# EAGLE design TS1 (EAGLE 9.5.1)
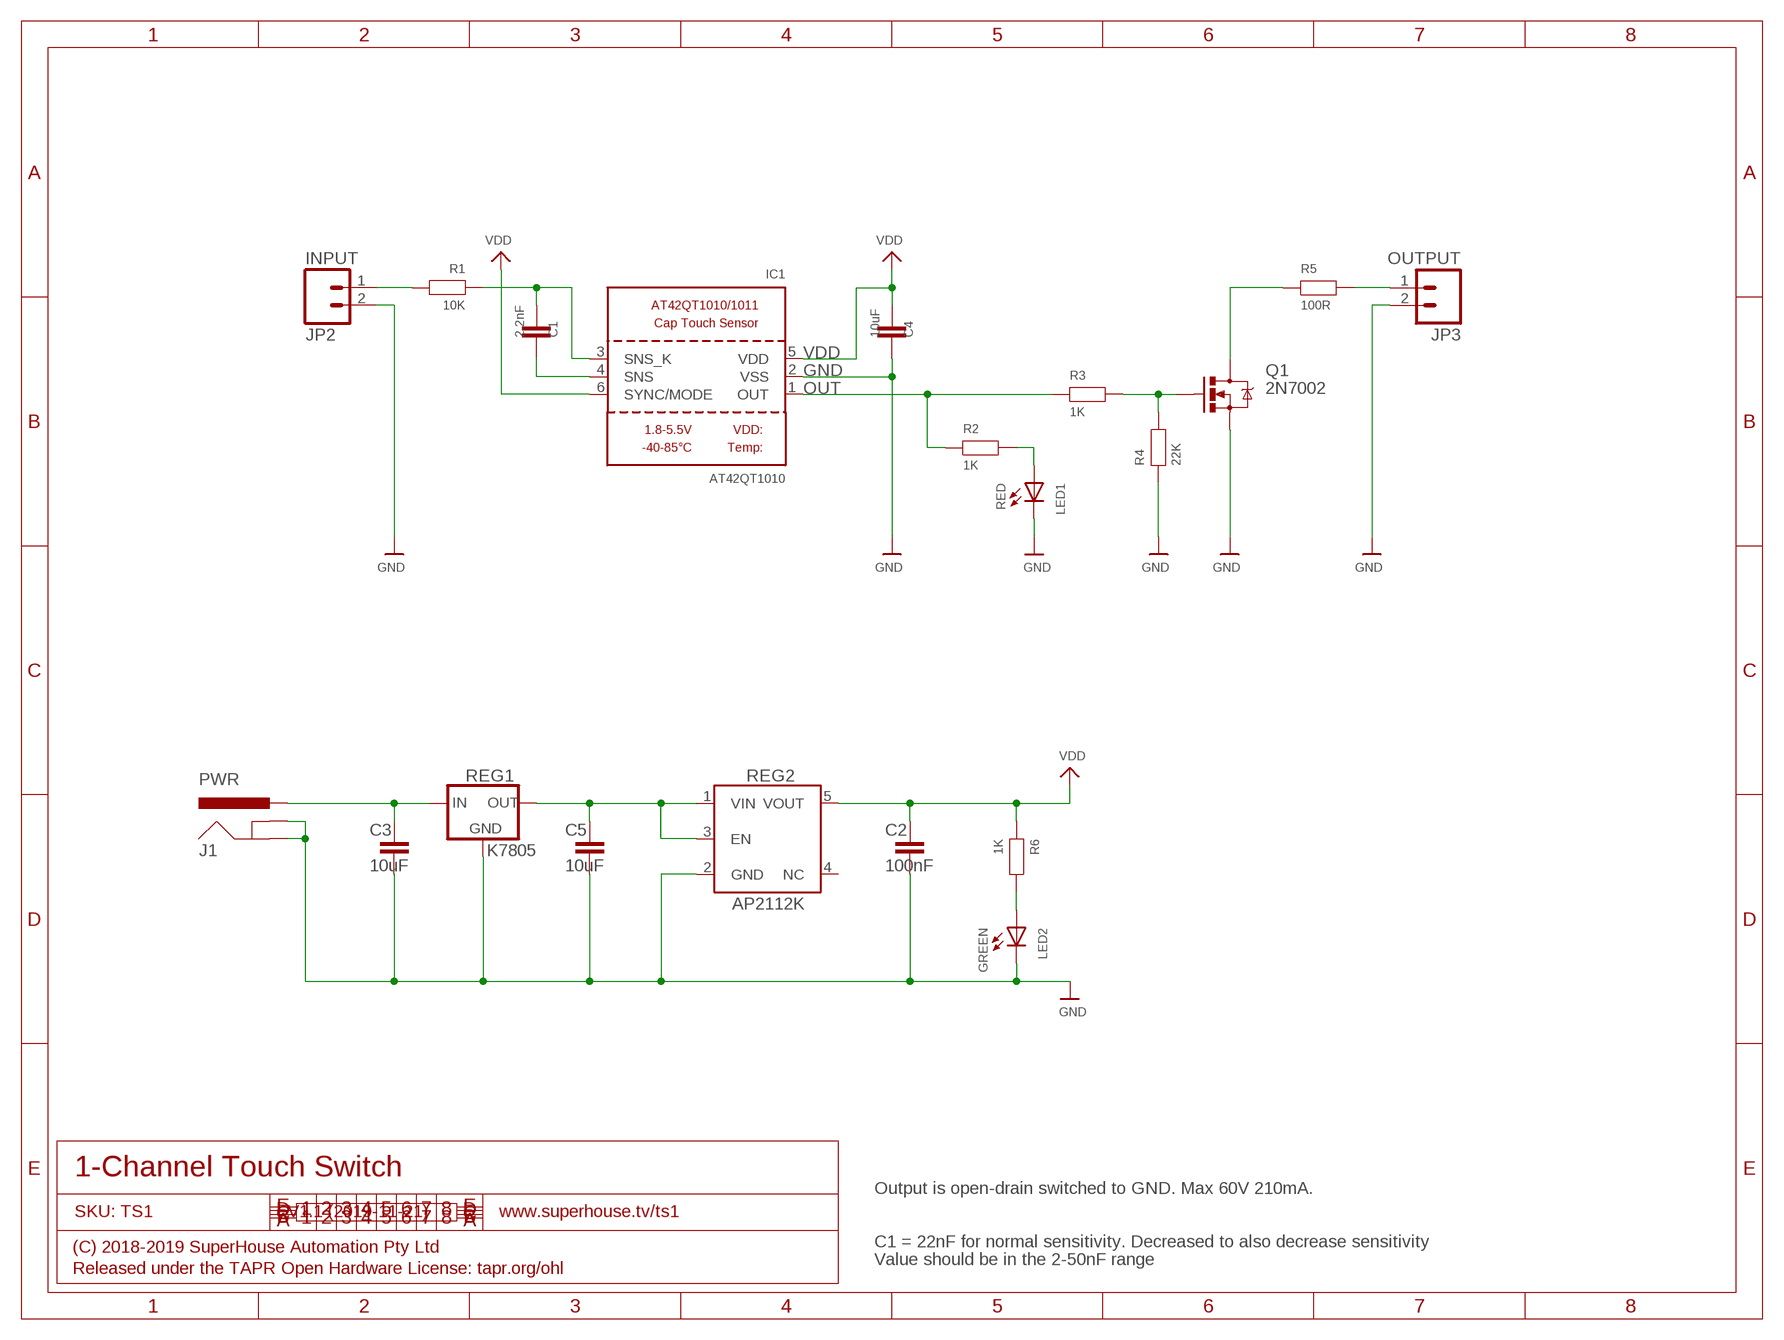
[diagram p0: schematic, sheet 1]

## Parts
C1  2.2nF  CAP0603  [C0603]
C2  100nF  CAP0603  [C0603]
C3  10uF  CAP0603  [C0603]
C4  10uF  CAP0603  [C0603]
C5  10uF  CAP0603  [C0603]
IC1  AT42QT1010  AT42QT1010/1  [SOT23-6]
J1  PWR  POWER_JACK-SLOTS  [POWER_JACK_SLOTS]
JP2  INPUT  M02-SOCKET  [1X02-S]
JP3  OUTPUT  M02-SOCKET  [1X02-S]
LED1  RED  LED0603  [LED-0603]
LED2  GREEN  LED0603  [LED-0603]
Q1  2N7002  MOSFET-NCHANNEL-233  [SOT23-3]
R1  10K  RESISTOR0603  [R0603]
R2  1K  RESISTOR0603  [R0603]
R3  1K  RESISTOR0603  [R0603]
R4  22K  RESISTOR0603  [R0603]
R5  100R  RESISTOR0603  [R0603]
R6  1K  RESISTOR0603  [R0603]
REG1  K7805  K78XX-500R3  [K78XX-500R3]
REG2  AP2112KSOT25  [SOT23-5]

## Nets
CAPPAD: JP2.1 R1.2
GND: C2.2 C3.2 C4.2 C5.2 IC1.2(VSS) J1.GND J1.GNDBREAK JP2.2 JP3.2 LED1.C LED2.C Q1.2(S) R4.1 REG1.2(GND) REG2.2(GND)
N$1: JP3.1 R5.2
N$2: Q1.3(D) R5.1
N$3: C1.2 IC1.4(SNS)
N$4: C1.1 IC1.3(SNS_K) R1.1
N$5: Q1.1(G) R3.2 R4.2
N$6: LED1.A R2.2
N$7: C3.1 J1.PWR REG1.1(IN)
N$8: C5.1 REG1.3(OUT) REG2.1(VIN) REG2.3(EN)
N$9: LED2.A R6.2
OUT: IC1.1(OUT) R2.1 R3.1
VDD: C2.1 C4.1 IC1.5(VDD) IC1.6(SYNC/MODE) R6.1 REG2.5(VOUT)
Unconnected: REG2.4(NC)

## Notes on the sheet
- 1-Channel Touch Switch
- Output is open-drain switched to GND. Max 60V 210mA.
- SKU: TS1 | V1.1 (2019-11-21) | www.superhouse.tv/ts1
- C1 = 22nF for normal sensitivity. Decreased to also decrease sensitivity
- (C) 2018-2019 SuperHouse Automation Pty Ltd
- Value should be in the 2-50nF range
- Released under the TAPR Open Hardware License: tapr.org/ohl

## Library data of the parts
C1-C5 = SuperHouse-DiscreteSemi:CAP: Capacitor Standard ceramic capacitor
IC1 = SuperHouse-ICs:AT42QT1010/1: AT42QT1010/1011 - Single Button Cap Touch Sensors AT42QT1010 - Auto recalibration AT42QT1011 - Remains on as long as touch is detected
J1 = SuperHouse-Connectors:POWER_JACK: Power Jack This is the standard 5.5mm barrel jack for power. The PTH is the most common, proven, reliable, footprint. All others are experimental. The Slot footprint only works if the mill layer is transmitted to the PCB fab house so be warned. Spark Fun Electronics SKU : PRT-00119. Mating wall wart : TOL-00298 (and others)
JP2 JP3 = SuperHouse-Connectors:M02: 2-way header Standard 1x2 header, and screw terminal variations
LED1 LED2 = SuperHouse-LEDs:LED: LEDs Standard schematic elements and footprints for 5mm, 3mm, 1206, and 0603 sized LEDs. 5mm - Spark Fun Electronics SKU : COM-00529 (and others)
Q1 = SuperHouse-DiscreteSemi:MOSFET-NCHANNEL: N-channel MOSFET
R1-R6 = SuperHouse-DiscreteSemi:RESISTOR: Resistor Standard resistors.
REG1 = SuperHouse-Regulators:K78XX-500R3: K78xx-500R3 switchmode voltage regulator
REG2 = SuperHouse-Regulators:AP2112K: AP2112K LDO linear voltage regulator

## Board
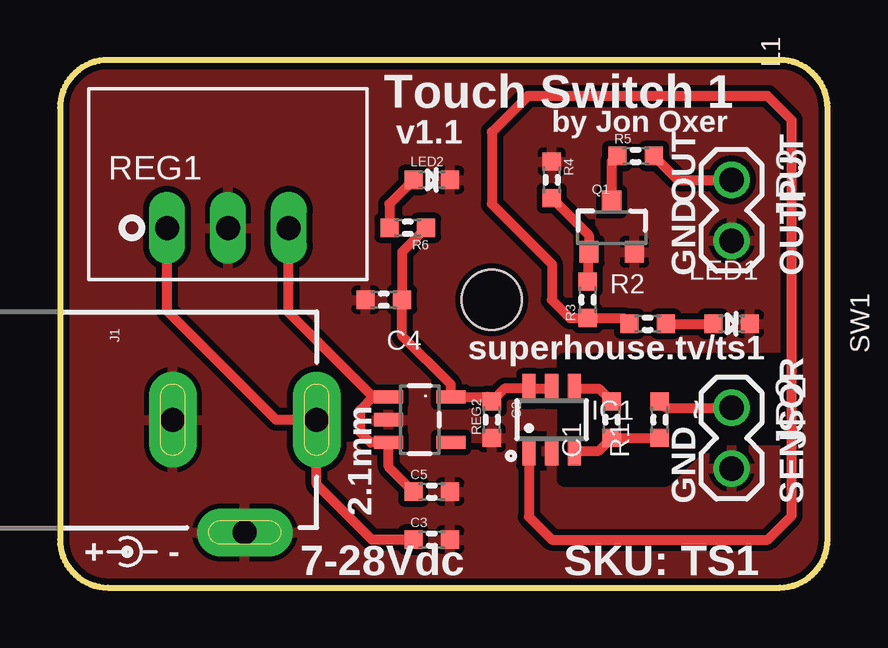
[diagram p1: board, top side]
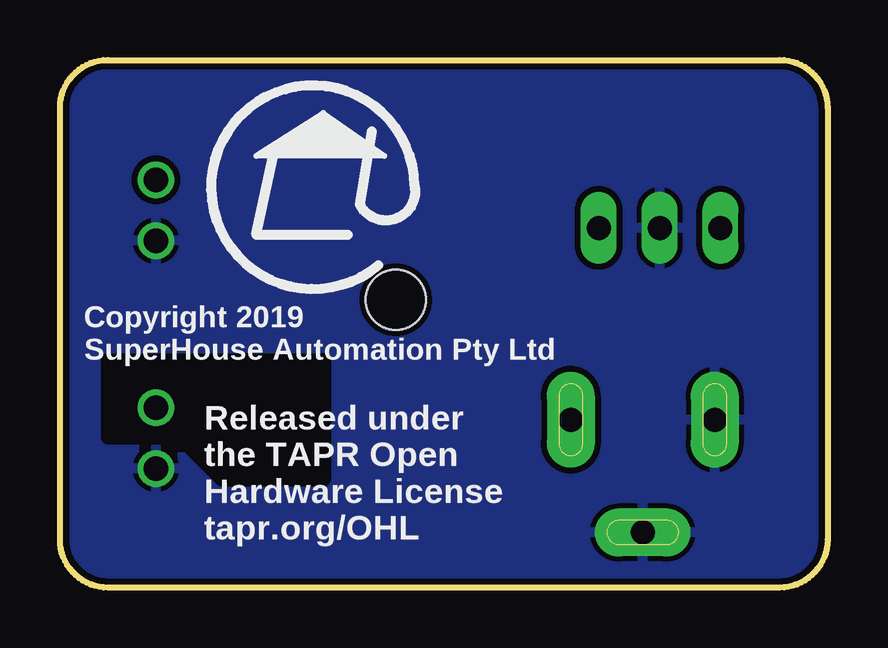
[diagram p2: board, bottom side, seen from below]

Size 32 x 22 mm. Coordinates in mm from the lower left corner, seen from the top.
Outline: 0,2 arc90 2,0 30,0 arc90 32,2 32,20 arc90 30,22 2,22 arc90 0,20 0,2
Copper layers (1*16): Top 0.035mm / dielectric 1.5mm / Bottom 0.035mm
Design rules "default *": minimum track width 8mil, minimum drill 0.4mm, track to track 8mil, track to pad 8mil, pad to pad 8mil, via to via 8mil, smd to smd 8mil, copper to edge 10mil, drill to drill 8mil, minimum pad ring 8mil, minimum via ring 10mil, stop-mask expansion 3mil, vias tented up to drill 25mil, thermal gap 8mil
Holes 2.5 mm at 18,12
tRestrict: 6 lines
bRestrict: 6 lines

### Footprints (pad centres in the part's own frame; a part is rotated, then mirrored left to right if it is on the bottom)
C0603 = smd 0.762 x 0.762: 1 -0.762,0; 2 0.762,0
SOT23-6 = smd 0.55 x 1.2: 1 -0.95,-1.3; 2 0,-1.3; 3 0.95,-1.3; 4 0.95,1.3; 5 0,1.3; 6 -0.95,1.3
POWER_JACK_SLOTS = drill 1 pad 2 long: GND 0,7.7; GNDBREAK 4.7,10.7; PWR 0,13.7
1X02-S = drill 1.016: 1 0,0; 2 2.54,0
LED-0603 = smd 0.762 x 0.762: A -0.762,0; C 0.762,0
SOT23-3 = smd 0.8 x 0.9: 1 -0.95,-1; 2 0.95,-1; 3 0,1.1
R0603 = smd 0.762 x 0.762: 1 -0.762,0; 2 0.762,0
K78XX-500R3 = drill 1 long: 1 -2.54,0; 2 0,0; 3 2.54,0
SOT23-5 = smd 0.55 x 1.2: 1 -0.95,-1.3; 2 0,-1.3; 3 0.95,-1.3; 4 0.95,1.3; 5 -0.95,1.3

### Placement (x,y rotation side)
C1  23,7 90 top
C2  18,7 270 top
C3  15.5,2 0 top
C4  13.5,12 180 top
C5  15.5,4 0 top
IC1  20.5,7 0 top
J1  -3,7 270 top
JP2  28,7.5 270 top
JP3  28,17 270 top
LED1  28,11 0 top
LED2  15.5,17 0 top
Q1  23,15 0 top
R1  25,7 90 top
R2  24.5,11 0 top
R3  22,12 90 top
R4  20.5,17 270 top
R5  24,18 0 top
R6  14.5,15 180 top
REG1  7,15 0 top
REG2  15,7 270 top

### Tracks (layer width: path | path; a pad name or v marks a point on that pad's centre or on a via)
CAPPAD
  Top 0.406: R1.2 25.26,7.5 JP2.1
GND
  pour Top (isolate 0.254): 2,22 30,22 arc-90 32,20 32,2 arc-90 30,0 2,0 arc-90 0,2 0,20 arc-90
  pour Bottom (isolate 0.254): 2,22 30,22 arc-90 32,20 32,2 arc-90 30,0 2,0 arc-90 0,2 0,20 arc-90
N$1
  Top 0.406: R5.2 25.76,17 JP3.1
N$2
  Top 0.406: Q1.3 23,17.76 R5.1
N$3
  Top 0.406: IC1.4 22.46,8.3 C1.2
N$4
  Top 0.406: IC1.3 22.46,5.7 C1.1 R1.1
N$5
  Top 0.406: R3.2 22,13.85 Q1.1 22.05,14.69 R4.2
N$6
  Top 0.406: R2.2 LED1.A
N$7
  Top 0.406: REG1.1 4.46,11.54 9,7 J1.PWR 10.7,4.3 13,2 C3.1
N$8
  Top 0.406: C5.1 13.7,5.04 REG2.3 12.95,6.05 12.5,6.5 12.5,7.39 13.06,7.95 | REG2.1 13.06,7.95 | 13.06,7.95 9.54,11.47 REG1.3
N$9
  Top 0.406: LED2.A 13.74,16 R6.2
OUT
  Top 0.406: R2.1 23.5,11.24 R3.1 21.26,11.24 20.5,12 20.5,13.5 18,16 18,19 19.5,20.5 29.5,20.5 30.5,19.5 30.5,3 29.5,2 20.5,2 19.55,2.95 IC1.1
VDD
  Top 0.406: REG2.5 16.3,8.46 14.26,10.5 C4.1 14.26,14 R6.1 | REG2.5 16.35,8 | IC1.5 IC1.6 18.54,8.3 C2.1 17.81,7.95 REG2.5

### Text on the board
tPlace: Touch Switch 1 | by Jon Oxer | v1.1 | OUT | GND | OUTPUT | superhouse.tv/ts1 | ~ | GND | SENSOR | 2.1mm | + | - | 7-28Vdc | SKU: TS1
bPlace: Copyright 2019 / SuperHouse Automation Pty Ltd | Released under / the TAPR Open / Hardware License / tapr.org/OHL
tNames: L1 | SW1